# EAGLE board IceLogicBus (EAGLE 7.5.0)
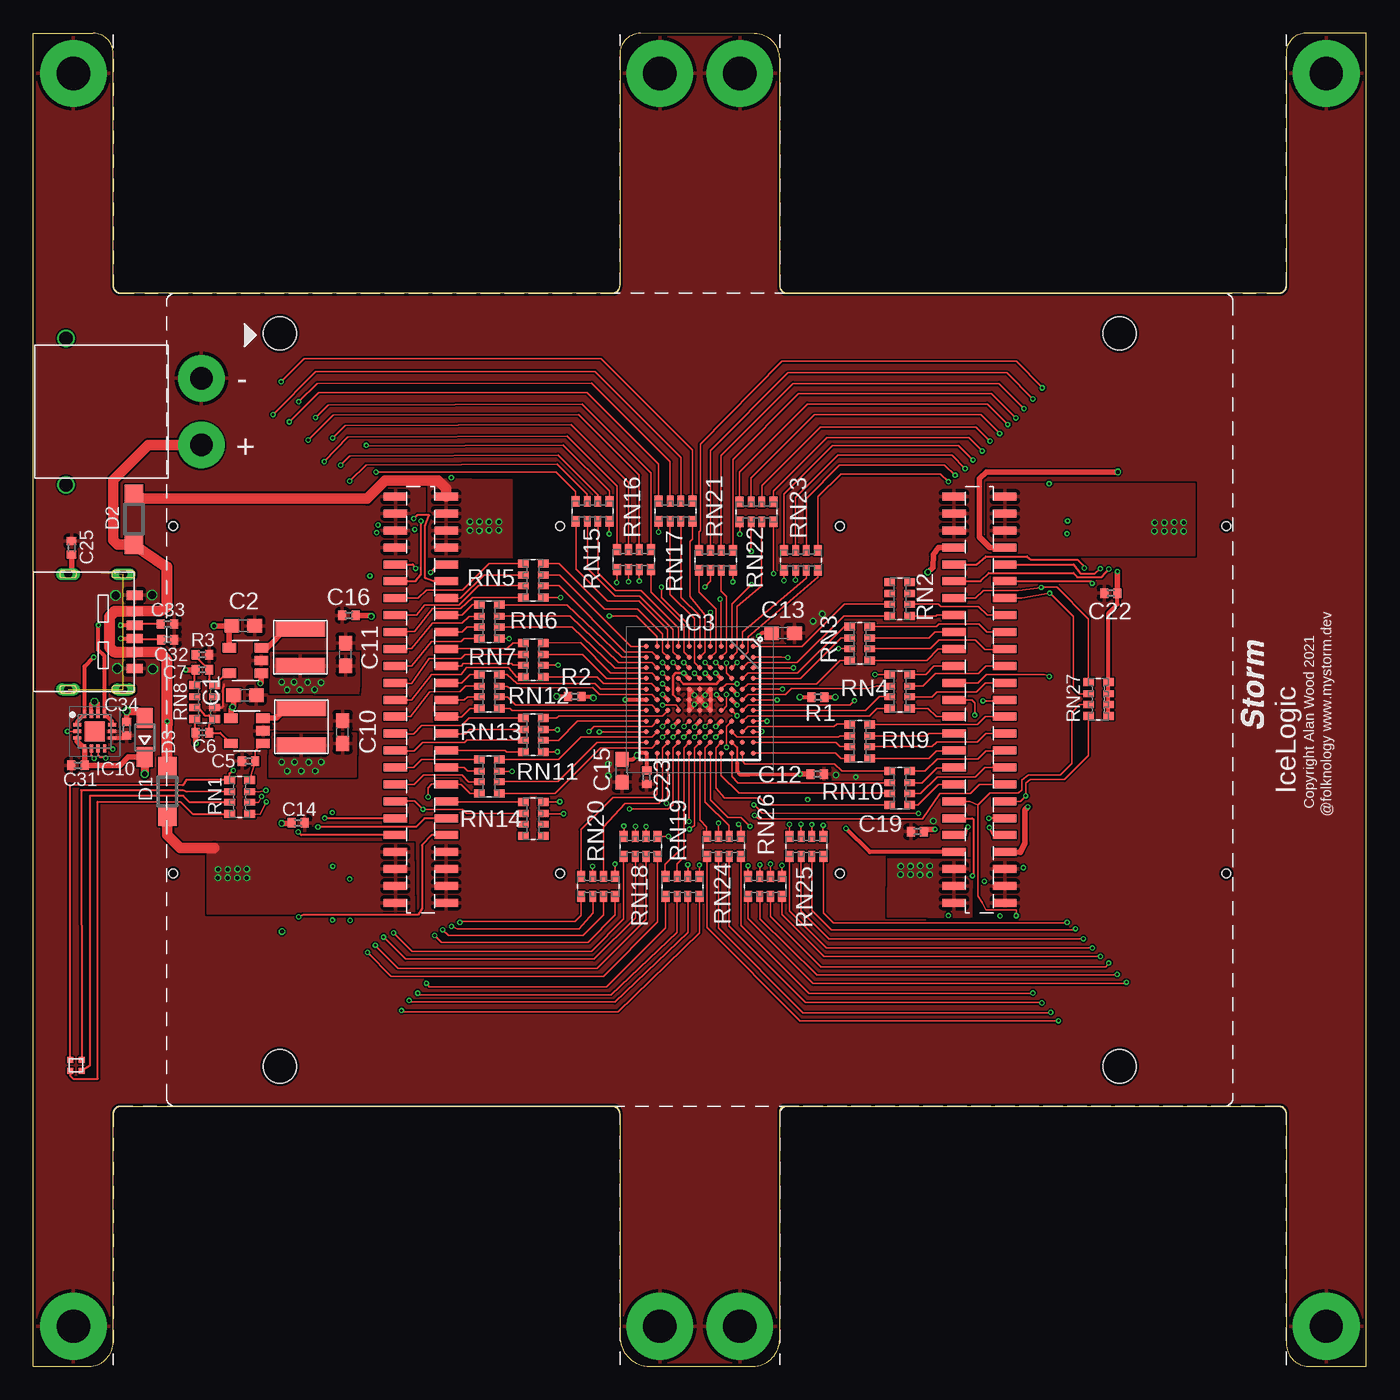
[diagram p1: board, top side]
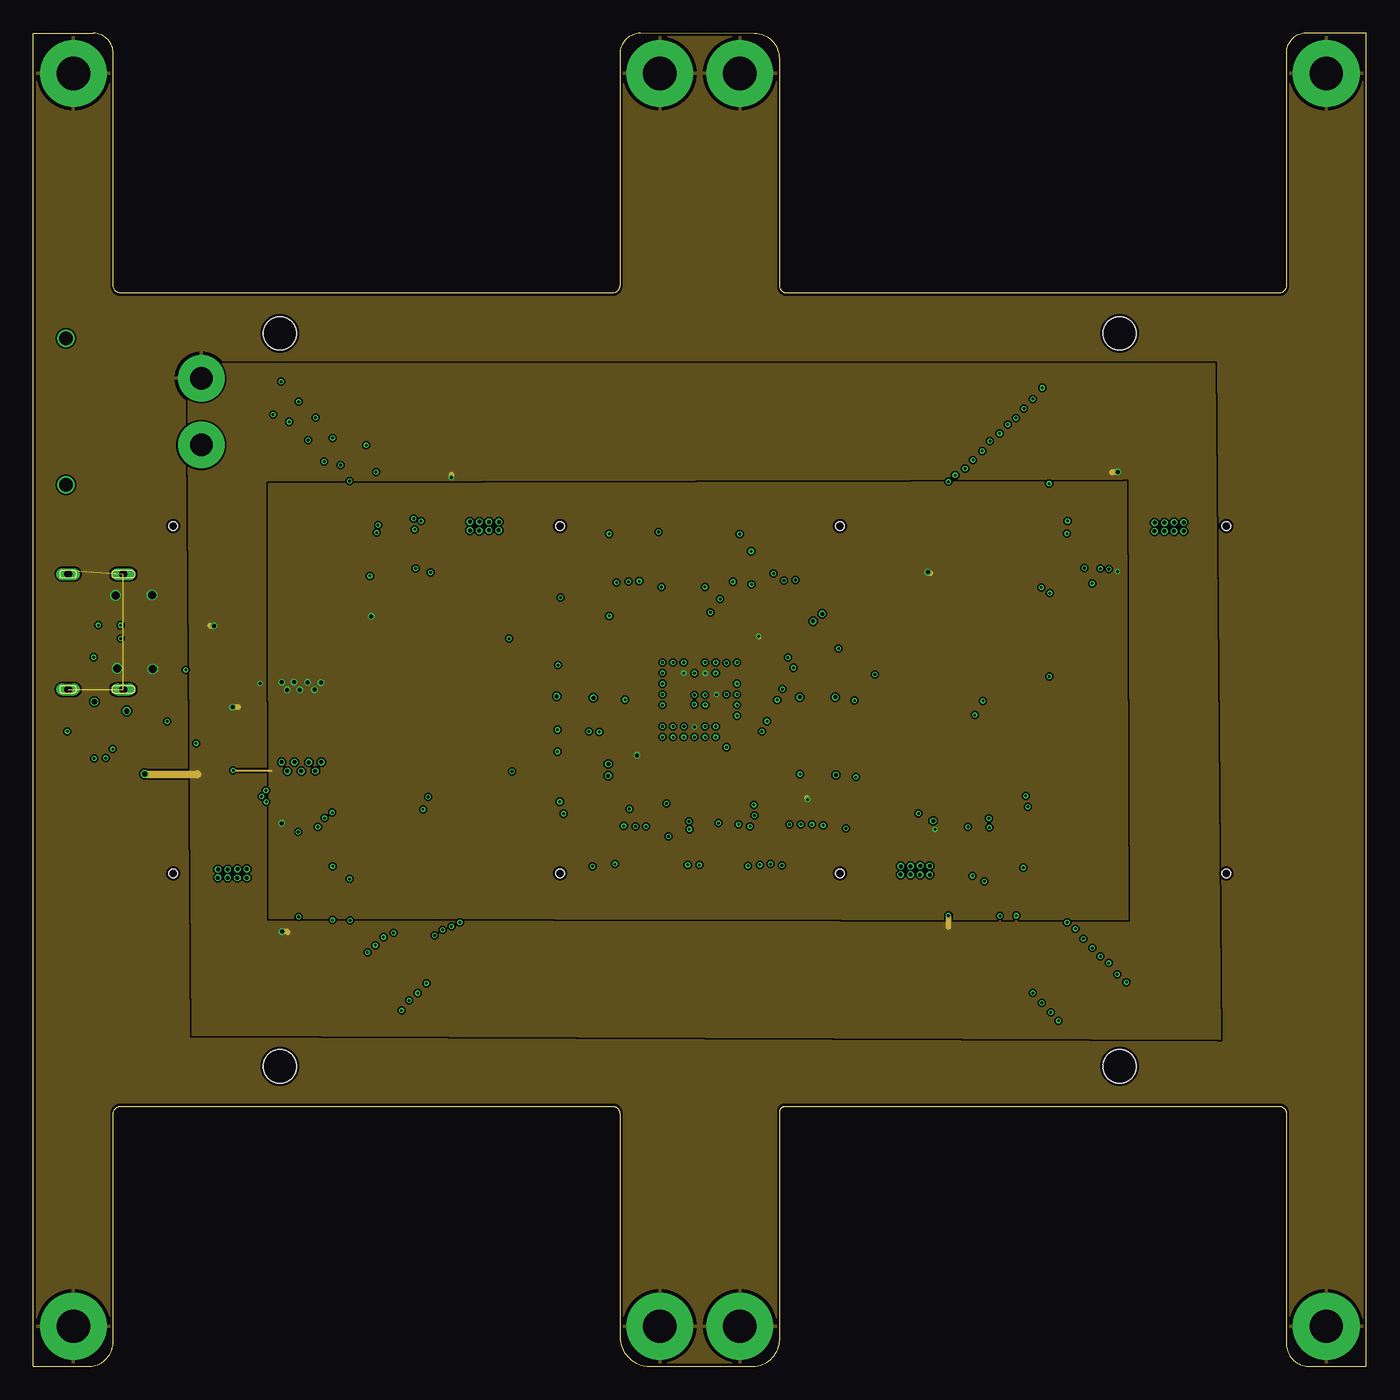
[diagram p2: board, inner layer Route2]
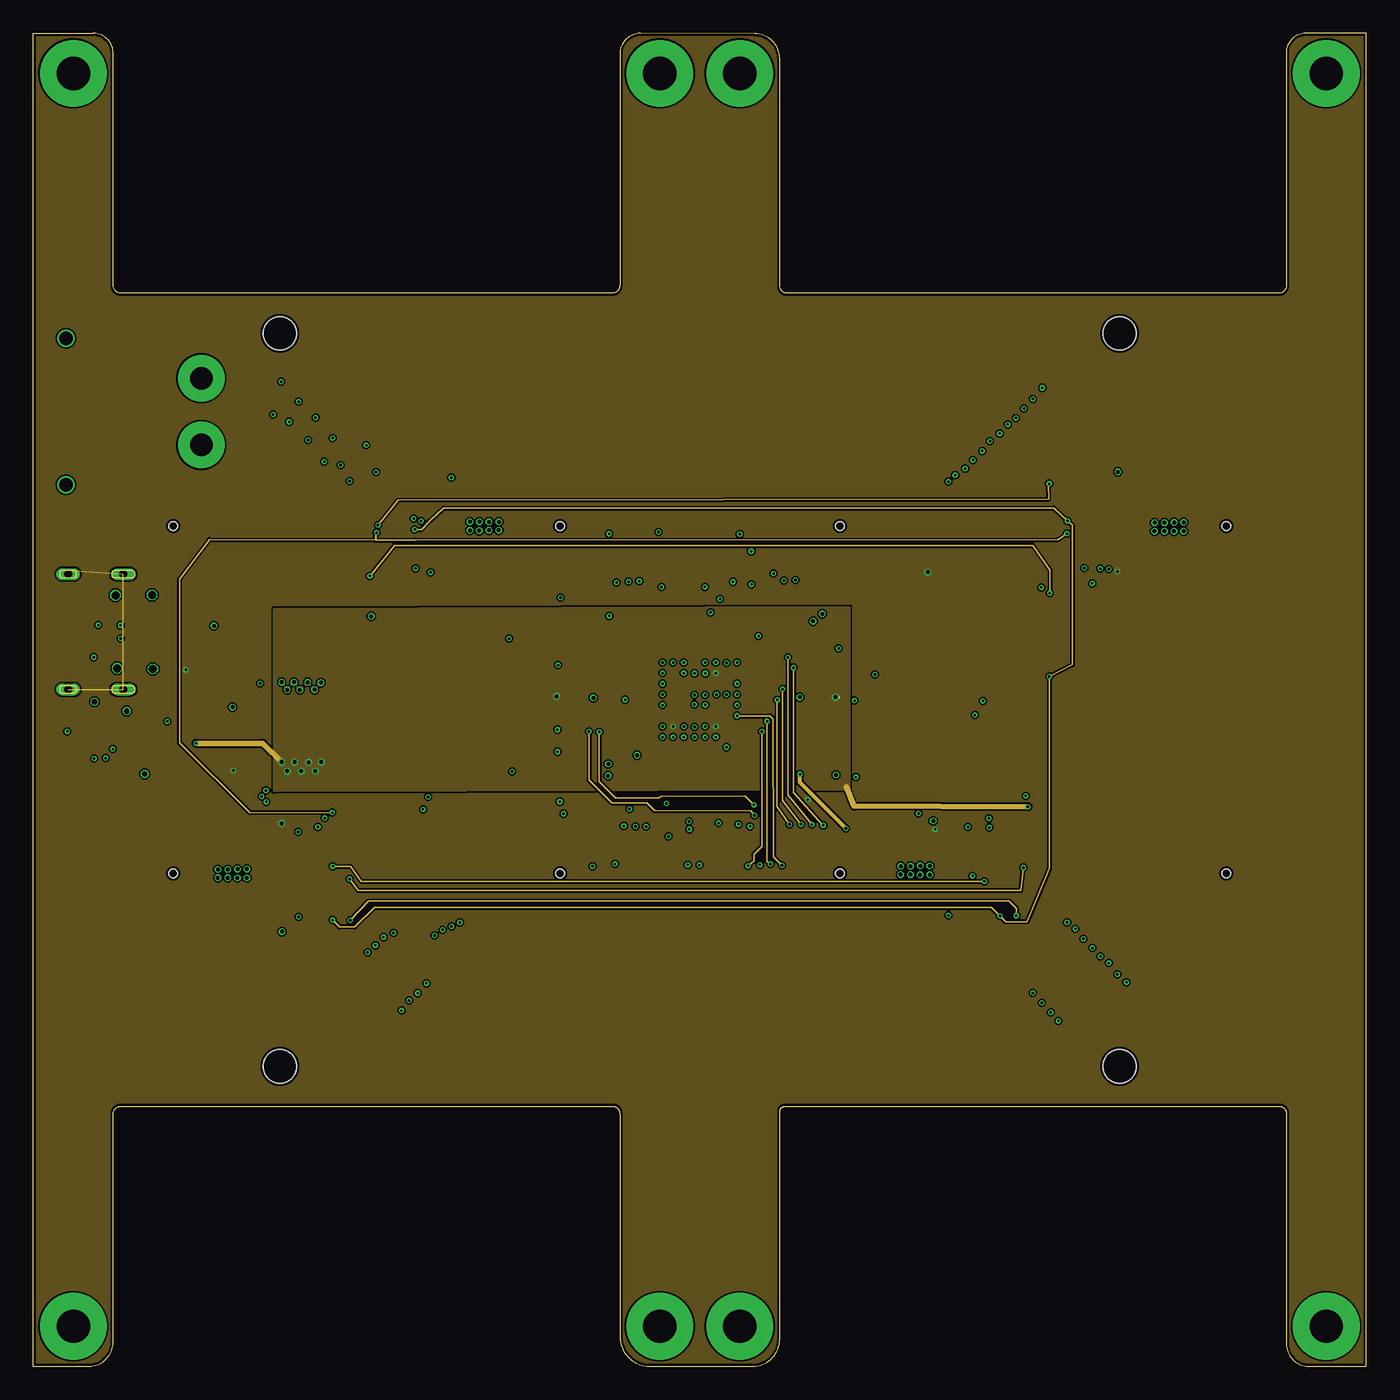
[diagram p3: board, inner layer Route15]
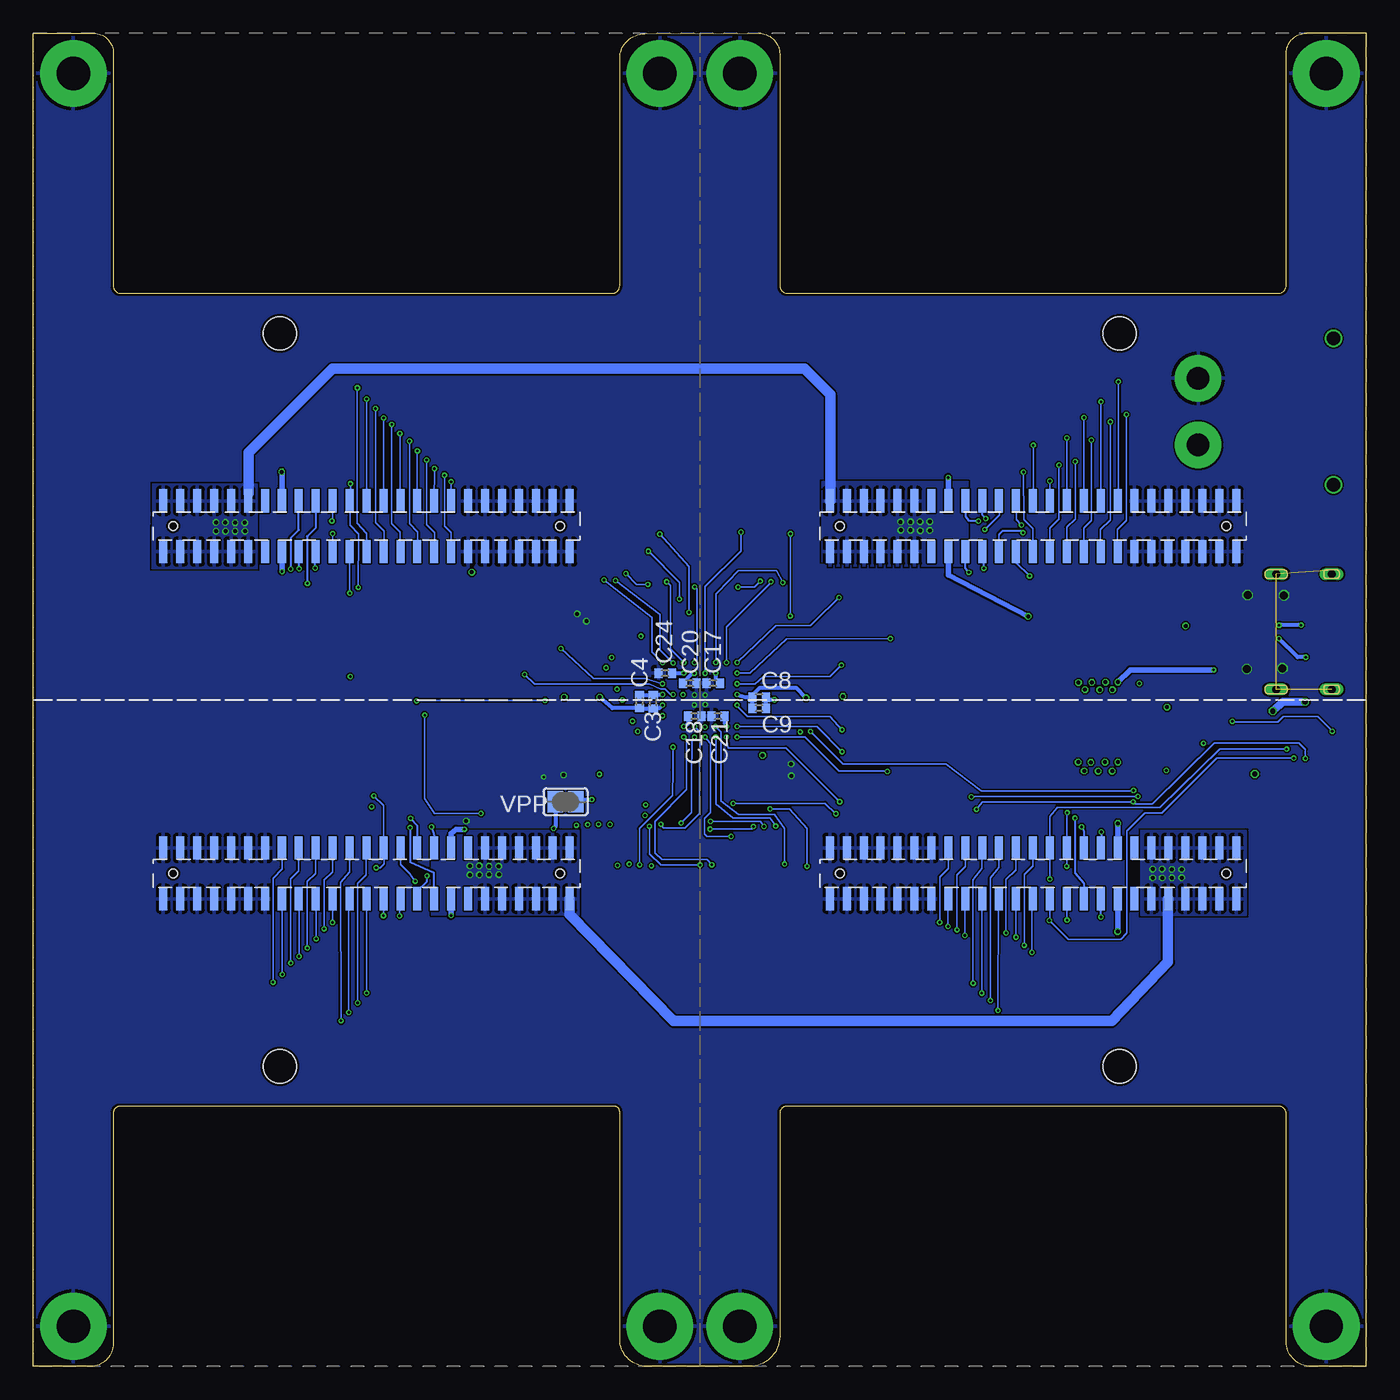
[diagram p4: board, bottom side, seen from below]

Size 100 x 100 mm. Coordinates in mm from the lower left corner, seen from the top.
Outline: 100,100 95.47,100 arc90 94,98.53 94,81.05 arc-90 93.45,80.5 56.56,80.5 arc-90 56,81.06 56,98.09 arc90 54.11,99.98 45.56,100 arc90 44,98.44 44,81.08 arc-90 43.42,80.5 6.59,80.5 arc-90 6,81.09 6,98.5 arc90 4.5,100 0,100 0,0 4.17,0 arc90 6,1.83 6,18.93 arc-90 6.57,19.5 43.46,19.5 arc-90 44,18.96 44,2.23 arc90 46.23,0 53.99,0 arc90 56,2.01 56,19.09 arc-90 56.41,19.5 93.5,19.5 arc-90 94,19 94,1.68 arc90 95.68,0 100,0 100,100
Copper layers (1*2*15*16): Top 0.035559375mm / dielectric 0.17018125mm / Route2 0.01778125mm / dielectric 47mil / Route15 0.01778125mm / dielectric 0.17018125mm / Bottom 0.035559375mm
Design rules "jcl-4layer *": minimum track width 3.5mil, minimum drill 0.2mm, track to track 5mil, track to pad 5mil, pad to pad 5mil, via to via 5mil, smd to smd 5mil, copper to edge 0.2mm, drill to drill 5mil, minimum pad ring 0.15mm, minimum via ring 0.09mm, stop-mask expansion 2.5mil, vias tented up to drill 0.3mm, thermal gap 10mil

## Footprints (pad centres in the part's own frame; a part is rotated, then mirrored left to right if it is on the bottom)
C0603 = smd 1.1 x 1: 1 -0.85,0; 2 0.85,0
C0402 = smd 0.6 x 0.7: 1 -0.5,0; 2 0.5,0
SOD123 = smd 1.4 x 1.4: A 1.9,0; C -1.9,0
SOD323-W = smd 1.5 x 1.2: A 1.45,0; C -1.45,0
TSOP-5/SOT23-5 = smd 0.7 x 1: 1 0.95,1.2; 2 0,1.2; 3 -0.95,1.2; 4 -0.95,-1.2; 5 0.95,-1.2
BGA121C80P11X11_900X900X110 = smd 0.37 x 0.37: A1 -4,4; A2 -3.2,4; A3 -2.4,4; A4 -1.6,4; A5 -0.8,4; A6 0,4; A7 0.8,4; A8 1.6,4; A9 2.4,4; A10 3.2,4; A11 4,4; B1 -4,3.2; B2 -3.2,3.2; B3 -2.4,3.2; B4 -1.6,3.2; B5 -0.8,3.2; B6 0,3.2; B7 0.8,3.2; B8 1.6,3.2; B9 2.4,3.2; B10 3.2,3.2; B11 4,3.2; C1 -4,2.4; C2 -3.2,2.4; C3 -2.4,2.4; C4 -1.6,2.4; C5 -0.8,2.4; C6 0,2.4; C7 0.8,2.4; C8 1.6,2.4; C9 2.4,2.4; C10 3.2,2.4; C11 4,2.4; D1 -4,1.6; D2 -3.2,1.6; D3 -2.4,1.6; D4 -1.6,1.6; D5 -0.8,1.6; D6 0,1.6; D7 0.8,1.6; D8 1.6,1.6; D9 2.4,1.6; D10 3.2,1.6; D11 4,1.6; E1 -4,0.8; E2 -3.2,0.8; E3 -2.4,0.8; E4 -1.6,0.8; E5 -0.8,0.8; E6 0,0.8; E7 0.8,0.8; E8 1.6,0.8; E9 2.4,0.8; E10 3.2,0.8; E11 4,0.8; F1 -4,0; F2 -3.2,0; F3 -2.4,0; F4 -1.6,0; F5 -0.8,0; F6 0,0; F7 0.8,0; F8 1.6,0; F9 2.4,0; F10 3.2,0; F11 4,0; G1 -4,-0.8; G2 -3.2,-0.8; G3 -2.4,-0.8; G4 -1.6,-0.8; G5 -0.8,-0.8; G6 0,-0.8; G7 0.8,-0.8; G8 1.6,-0.8; G9 2.4,-0.8; G10 3.2,-0.8; G11 4,-0.8; H1 -4,-1.6; H2 -3.2,-1.6; H3 -2.4,-1.6; H4 -1.6,-1.6; H5 -0.8,-1.6; H6 0,-1.6; H7 0.8,-1.6; H8 1.6,-1.6; H9 2.4,-1.6; H10 3.2,-1.6; H11 4,-1.6; J1 -4,-2.4; J2 -3.2,-2.4; J3 -2.4,-2.4; J4 -1.6,-2.4; J5 -0.8,-2.4; J6 0,-2.4; J7 0.8,-2.4; J8 1.6,-2.4; J9 2.4,-2.4; J10 3.2,-2.4; J11 4,-2.4; K1 -4,-3.2; K2 -3.2,-3.2; K3 -2.4,-3.2; K4 -1.6,-3.2; K5 -0.8,-3.2; K6 0,-3.2; K7 0.8,-3.2; K8 1.6,-3.2; K9 2.4,-3.2; K10 3.2,-3.2; K11 4,-3.2; L1 -4,-4; L2 -3.2,-4; L3 -2.4,-4; L4 -1.6,-4; L5 -0.8,-4; L6 0,-4; L7 0.8,-4; L8 1.6,-4; L9 2.4,-4; L10 3.2,-4; L11 4,-4
QFN50P250X250X80-15N = smd 0.6 x 0.25: 1 -1.3,0.5; 2 -1.3,0; 3 -1.3,-0.5; 8 1.3,-0.5; 9 1.3,0; 10 1.3,0.5 | smd 0.25 x 0.6: 4 -0.75,-1.3; 5 -0.25,-1.3; 6 0.25,-1.3; 7 0.75,-1.3; 11 0.75,1.3; 12 0.25,1.3; 13 -0.25,1.3; 14 -0.75,1.3 | smd 1.5 x 1.5: 15 0,0
NRC4018 = smd 1.2 x 3.7: P$1 -1.4,0; P$2 1.4,0
RGB_LED_IMM = smd 0.45 x 0.45: A 0.425,0.425; B -0.425,0.425; G -0.425,-0.425; R 0.425,-0.425
R0402 = smd 0.6 x 0.7: 1 -0.5,0; 2 0.5,0
EXB38V = smd 0.6 x 0.8: 1 -1.275,-0.75; 4 1.275,-0.75; 5 1.275,0.75; 8 -1.275,0.75 | smd 0.5 x 0.8: 2 -0.4,-0.75; 3 0.4,-0.75; 6 0.4,0.75; 7 -0.4,0.75
UTILE_LP = drill 2.5 pad 5: 0V@1 22.5,22; 0V@2 22.5,-22 | smd 1.75 x 0.6: P$1 -13.385,-15.24; P$2 -13.385,-13.97; P$3 -13.385,-12.7; P$4 -13.385,-11.43; P$5 -13.385,-10.16; P$6 -13.385,-8.89; P$7 -13.385,-7.62; P$8 -13.385,-6.35; P$9 -13.385,-5.08; P$10 -13.385,-3.81; P$11 -13.385,-2.54; P$12 -13.385,-1.27; P$13 -13.385,0; P$14 -13.385,1.27; P$15 -13.385,2.54; P$16 -13.385,3.81; P$17 -13.385,5.08; P$18 -13.385,6.35; P$19 -13.385,7.62; P$20 -13.385,8.89; P$21 -13.385,10.16; P$22 -13.385,11.43; P$23 -13.385,12.7; P$24 -13.385,13.97; P$25 -13.385,15.24; P$26 -9.575,-15.24; P$27 -9.575,-13.97; P$28 -9.575,-12.7; P$29 -9.575,-11.43; P$30 -9.575,-10.16; P$31 -9.575,-8.89; P$32 -9.575,-7.62; P$33 -9.575,-6.35; P$34 -9.575,-5.08; P$35 -9.575,-3.81; P$36 -9.575,-2.54; P$37 -9.575,-1.27; P$38 -9.575,0; P$39 -9.575,1.27; P$40 -9.575,2.54; P$41 -9.575,3.81; P$42 -9.575,5.08; P$43 -9.575,6.35; P$44 -9.575,7.62; P$45 -9.575,8.89; P$46 -9.575,10.16; P$47 -9.575,11.43; P$48 -9.575,12.7; P$49 -9.575,13.97; P$50 -9.575,15.24 | hole 0.65: -11.48,14.5; -11.48,-14.5
MEZZANINE = smd 1.75 x 0.6: E1 -22.885,15.24; E2 -22.885,13.97; E3 -22.885,12.7; E4 -22.885,11.43; E5 -22.885,10.16; E6 -22.885,8.89; E7 -22.885,7.62; E8 -22.885,6.35; E9 -22.885,5.08; E10 -22.885,3.81; E11 -22.885,2.54; E12 -22.885,1.27; E13 -22.885,0; E14 -22.885,-1.27; E15 -22.885,-2.54; E16 -22.885,-3.81; E17 -22.885,-5.08; E18 -22.885,-6.35; E19 -22.885,-7.62; E20 -22.885,-8.89; E21 -22.885,-10.16; E22 -22.885,-11.43; E23 -22.885,-12.7; E24 -22.885,-13.97; E25 -22.885,-15.24; E26 -19.075,15.24; E27 -19.075,13.97; E28 -19.075,12.7; E29 -19.075,11.43; E30 -19.075,10.16; E31 -19.075,8.89; E32 -19.075,7.62; E33 -19.075,6.35; E34 -19.075,5.08; E35 -19.075,3.81; E36 -19.075,2.54; E37 -19.075,1.27; E38 -19.075,0; E39 -19.075,-1.27; E40 -19.075,-2.54; E41 -19.075,-3.81; E42 -19.075,-5.08; E43 -19.075,-6.35; E44 -19.075,-7.62; E45 -19.075,-8.89; E46 -19.075,-10.16; E47 -19.075,-11.43; E48 -19.075,-12.7; E49 -19.075,-13.97; E50 -19.075,-15.24; W1 19.025,15.24; W2 19.025,13.97; W3 19.025,12.7; W4 19.025,11.43; W5 19.025,10.16; W6 19.025,8.89; W7 19.025,7.62; W8 19.025,6.35; W9 19.025,5.08; W10 19.025,3.81; W11 19.025,2.54; W12 19.025,1.27; W13 19.025,0; W14 19.025,-1.27; W15 19.025,-2.54; W16 19.025,-3.81; W17 19.025,-5.08; W18 19.025,-6.35; W19 19.025,-7.62; W20 19.025,-8.89; W21 19.025,-10.16; W22 19.025,-11.43; W23 19.025,-12.7; W24 19.025,-13.97; W25 19.025,-15.24; W26 22.835,15.24; W27 22.835,13.97; W28 22.835,12.7; W29 22.835,11.43; W30 22.835,10.16; W31 22.835,8.89; W32 22.835,7.62; W33 22.835,6.35; W34 22.835,5.08; W35 22.835,3.81; W36 22.835,2.54; W37 22.835,1.27; W38 22.835,0; W39 22.835,-1.27; W40 22.835,-2.54; W41 22.835,-3.81; W42 22.835,-5.08; W43 22.835,-6.35; W44 22.835,-7.62; W45 22.835,-8.89; W46 22.835,-10.16; W47 22.835,-11.43; W48 22.835,-12.7; W49 22.835,-13.97; W50 22.835,-15.24 | hole 2.5: -31.5,-27.5; 31.5,-27.5; -31.5,27.5; 31.5,27.5
USB-C-6 = smd 0.7 x 1.2: CC1 -0.5,5; CC2 0.5,5; GND@1 -2.75,5; GND@2 2.75,5; VBUS@1 -1.52,5; VBUS@2 1.52,5 | drill 0.6 long: P$1 -4.32,4.15; P$2 4.32,4.15; P$3 -4.32,0; P$4 4.32,0
XT30PW-M = drill 1.7 pad 3.5: P$1 2.5,0; P$2 -2.5,0 | drill 1: P$3 -5.5,10.16; P$4 5.5,10.16
SJ = smd 1.168 x 1.6: 1 -0.762,0; 2 0.762,0

## Placement (x,y rotation side)
C1  22uf  [C0603]  15.88,50.35 180 top
C2  22uf  [C0603]  15.75,55.55 180 top
C3  470nf  [C0402]  53.5,49.85 270 bottom
C4  4u7  [C0402]  54.52,49.88 270 bottom
C5  470nf  [C0402]  16.15,45.39 180 top
C6  22pf  [C0402]  12.68,47.52 180 top
C7  22pf  [C0402]  12.68,52.25 180 top
C8  4u7  [C0402]  45.55,50.2 180 bottom
C9  470nf  [C0402]  45.55,49.37 180 bottom
C10  22uf  [C0603]  23.2,47.58 90 top
C11  22uf  [C0603]  23.43,53.4 90 top
C12  470nf  [C0402]  58.82,44.41 180 top
C13  22uf  [C0603]  56.26,55 0 top
C14  470nf  [C0402]  19.87,40.77 180 top
C15  22uf  [C0603]  44.16,44.67 90 top
C16  470nf  [C0402]  23.68,56.34 0 top
C17  470nf  [C0402]  49,51.25 180 bottom
C18  470nf  [C0402]  50.38,48.77 180 bottom
C19  470nf  [C0402]  66.33,40.1 0 top
C20  470nf  [C0402]  50.75,51.25 0 bottom
C21  470nf  [C0402]  48.63,48.77 0 bottom
C22  470nf  [C0402]  80.84,57.99 0 top
C23  470nf  [C0402]  46.02,44.2 270 top
C24  470nf  [C0402]  52.6,52 0 bottom
C25  470nf  [C0402]  2.87,61.4 270 top
C31  470nf  [C0402]  3.35,45.08 0 top
C32  470pf  [C0402]  10.08,54.51 180 top
C33  470pf  [C0402]  10.07,55.68 0 top
C34  470nf  [C0402]  7.01,47.83 90 top
D1  [SOD123]  10.05,43.12 90 top
D2  [SOD123]  7.54,63.53 270 top
D3  [SOD323-W]  8.35,47.17 90 top
IC1  [TSOP-5/SOT23-5]  16.02,47.67 270 top
IC2  [TSOP-5/SOT23-5]  15.9,52.95 270 top
IC3  ICE40HX4K-BG121  [BGA121C80P11X11_900X900X110]  50,50 270 top
IC10  FUSB302MPX  [QFN50P250X250X80-15N]  4.6,47.63 0 top
L1  NRS4018  [NRC4018]  20.1,47.98 270 top
L2  NRS4018  [NRC4018]  20.02,53.95 270 top
L3  RGB_LED  [RGB_LED_IMM]  3.19,22.57 90 top
R1  100r  [R0402]  58.87,50.2 180 top
R2  100r  [R0402]  40.63,50.25 180 top
R3  27k  [R0402]  12.68,53.38 0 top
RN1  1k5  [EXB38V]  15.47,42.7 270 top
RN2  22r  [EXB38V]  65,57.58 270 top
RN3  22r  [EXB38V]  62,54.23 90 top
RN4  22r  [EXB38V]  65,50.62 90 top
RN5  22r  [EXB38V]  37.5,58.95 270 top
RN6  22r  [EXB38V]  34.2,55.86 270 top
RN7  22r  [EXB38V]  37.5,52.99 270 top
RN8  120k  [EXB38V]  12.85,49.83 90 top
RN9  22r  [EXB38V]  62,46.88 90 top
RN10  22r  [EXB38V]  65,43.37 90 top
RN11  22r  [EXB38V]  34.2,44.25 270 top
RN12  22r  [EXB38V]  34.2,50.62 270 top
RN13  22r  [EXB38V]  37.5,47.37 270 top
RN14  22r  [EXB38V]  37.5,41.06 270 top
RN15  22r  [EXB38V]  41.95,64.14 0 top
RN16  22r  [EXB38V]  45.05,60.52 0 top
RN17  22r  [EXB38V]  48.17,64.15 0 top
RN18  22r  [EXB38V]  45.57,39 0 top
RN19  22r  [EXB38V]  48.7,36 0 top
RN20  22r  [EXB38V]  42.38,36 0 top
RN21  22r  [EXB38V]  51.2,60.48 0 top
RN22  22r  [EXB38V]  54.26,64.1 0 top
RN23  22r  [EXB38V]  57.59,60.48 0 top
RN24  22r  [EXB38V]  51.8,39 0 top
RN25  22r  [EXB38V]  58,39 0 top
RN26  22r  [EXB38V]  54.9,36 0 top
RN27  2k4  [EXB38V]  79.92,50.04 90 top
T1  UTILE_LPCARRIER_SMD_MALE_1.27  [UTILE_LP]  25,74.5 90 bottom
T2  UTILE_LPCARRIER_SMD_MALE_1.27  [UTILE_LP]  25,25.5 270 bottom
T3  [MEZZANINE]  50,50 180 top
T4  UTILE_LPCARRIER_SMD_MALE_1.27  [UTILE_LP]  75,74.5 90 bottom
T5  UTILE_LPCARRIER_SMD_MALE_1.27  [UTILE_LP]  75,25.5 270 bottom
U$1  USB-C-6  [USB-C-6]  2.6,55.1 270 top
U$2  XT-XXXT  [XT30PW-M]  12.61,71.62 90 top
VPP  [SJ]  60.07,42.34 180 bottom

## Tracks (layer width: path | path; a pad name or v marks a point on that pad's centre or on a via)
!CS0
  Top 0.127: RN5.3 33.41,58.55 31.95,57.12 29.37,57.12 28.76,56.35 T3.W43
!CS1
  Top 0.127: RN5.1 34.19,60.23 32.2,58.24 29.5,58.24 28.88,57.62 T3.W44
!HB
  Top 0.127: RN12.1 32.78,51.9 32.14,51.26 T3.W14
!INT  (via drill 0.2)
  Top 0.127: RN14.2 32.52,41.47 32.2,41.78 v29.23,41.78 28.62,42.39 27.18,42.39 T3.W32 | RN1.5 17.02,41.41 v17.48,42.34 | IC10.5 4.35,45.84 v4.56,45.6
  Bottom 0.127: v29.23,41.78 28.8,42.34 v17.48,42.34 17.36,42.18 16.03,42.19 11.38,46.74 5.05,46.74 4.56,46.28 v4.56,45.6
!LB
  Top 0.127: RN12.2 32.44,51.02 32.02,50.61 29.72,50.6 28.31,48.73 T3.W37
!OE
  Top 0.127: RN4.3 66.74,51.02 67.69,51.97 70.92,51.97 71.48,52.53 72.88,52.53 T3.E15
!SS  (via drill 0.2)
  Top 0.127: RN11.4 32.78,42.98 32.11,43.65 T3.W8 30.95,43.67 29.89,43.67 29.62,43.4 v29.62,42.71 | RN1.6 16.91,42.3 v17.12,42.74
  Bottom 0.127: v17.12,42.74 29.37,42.75 v29.62,42.71
!WE
  Top 0.127: RN4.4 66.95,51.9 67.58,52.52 69.06,52.52 T3.E40
+2V5  (via drill 0.2)
  Top 0.15: IC3.C10 52.8,46.43 52.8,45.23
  Top 0.3: 52.8,45.23 52.8,44.64 53.03,44.41 53.73,44.41 v57.53,44.41 C12.2 | T3.E29 62.75,38.57 v60.97,40.35
  Top 0.406: v57.53,44.41 C12.2
  Route15 0.3: v60.97,40.35 57.53,43.79 v57.53,44.41
  Bottom 0.3: VPP.2 60.83,40.49 v60.97,40.35
+3V3  (via drill 0.2, 0.3)
  Top 0.15: RN8.5 12.1,52.17 C7.2 | L3.A 2.74,23.02 2.74,23.6 2.72,43.59 11.2,43.58 11.45,43.98 RN1.1 14.72,44.48 v15,44.69
  Top 0.17: 48,50.41 48,51.77 48.19,52 v48.8,52
  Top 0.2: 50,48.49 IC3.F8 | IC3.H6 48,50.41
  Top 0.3: IC3.D6 v51.26,50.38 | IC3.F8 49.61,48.01 v49.61,47.96 | IC3.G4 49.17,51.6 v48.8,52 | C23.1 46.02,45.98 IC3.L11 45.46,46 v45.29,45.83 44.98,45.52 C15.2 | IC3.E4 v50.41,51.99 | C13.1 54.65,55 v54.42,54.77
  Top 0.305: RN27.1 RN27.2 RN27.3 RN27.4 80.67,56.5 81.34,57.17 C22.2
  Top 0.406: C7.2 v11.45,52.25 v11.44,52.24 | v18.63,40.73 19.34,40.73 C14.2 | v25.36,56.25 25.36,56.34 C16.2 | v67.65,40.28 66.91,40.28 C19.2 | v81.34,59.62 C22.2 | T3.E47 67.92,61.43 67.52,60.9 67.49,59.92 v67.11,59.57
  Route2 0.15: v15,44.69 17.82,44.69 17.85,44.66
  Route2 0.3: v54.42,54.77 54.42,54.7 54.45,54.67
  Route2 0.406: v67.11,59.57 67.3,59.51 | v58.1,42.51 58.03,42.64
  Bottom 0.3: v45.29,45.83 v45.28,45.83 45.25,45.8 | C17.1 48.8,51.55 v48.8,52 | C20.1 50.58,51.98 v50.41,51.99 | VPP.1 58.94,42.51 v58.1,42.51
  Bottom 0.406: v11.44,52.24 17.71,52.24 v18.63,51.32 | T2.P$18 18.65,40.71 v18.63,40.73 | T1.P$18 31.34,59.38 v25.36,56.25 | T5.P$18 68.65,39.96 68.3,40.28 v67.65,40.28 | T4.P$18 v81.35,59.63 v81.34,59.62
  other vias: 19.04,50.75 19.56,51.32 19.99,50.75 20.58,51.31 21.1,50.76 21.58,51.29
  pour Route15 (rank 2): 0,100 100,100 100,0 0,0
  pour Top: 24.38,50.45 17.82,50.49 17.77,53.54 24.39,53.57 24.43,51.15
  pour Route2: 17.7,66.22 81.95,66.38 82.07,33.49 17.75,33.59
+5V  (via drill 0.2, 0.3, 0.4)
  Top 0.406: v13.55,55.54 v13.56,55.55 C2.2 14.7,55.35 IC2.4 | IC2.1 17.1,51.3 v17.02,51.22 | C1.2 15.03,49.52 v14.95,49.45 14.82,49.33 IC1.4 | T3.E22 71.78,61.43 70.99,62.22 70.99,66.6 71.49,67.1 v81.36,67.1 v81.37,67.09 | IC10.3 3.3,46.88 IC10.4 C31.2 6.51,45.08 7.11,45.72 D3.C
  Top 0.61: D3.C 8.35,44.41 v8.36,44.43
  Route2 0.406: v13.55,55.54 13.31,55.54 13.27,55.58 | v17.02,51.22 v17.03,51.23 | v14.95,49.45 15.35,49.45 15.36,49.46 | v18.65,32.61 19.03,32.61 19.09,32.55 | v31.36,66.67 31.37,66.91 | v81.37,67.09 80.96,67.09 80.92,67.05 | v68.66,33.81 68.66,32.97
  Route2 0.61: v8.36,44.43 12.3,44.4
  Bottom 0.406: T2.P$43 v18.65,32.61 | T1.P$43 v31.36,66.67 | T4.P$43 81.35,67.07 v81.37,67.09 | T5.P$43 v68.65,33.82 v68.66,33.81
  pour Route2 (rank 2): 11.63,75.26 88.61,75.22 89.01,24.52 11.96,24.81
A4
  Top 0.127: RN13.1 32.69,48.64 32.12,48.07 29.14,48.07 28.52,47.45 27.18,47.45 T3.W36
A5
  Top 0.127: RN13.2 32.74,47.77 32.42,47.44 31,47.44 T3.W11
A6
  Top 0.127: RN12.3 32.56,50.23 32.32,49.98 31,49.98 T3.W13
A7
  Top 0.127: RN13.4 35.49,46.09 35.4,46.18 T3.W10
A8
  Top 0.127: RN12.4 32.75,49.35 32.12,48.72 T3.W12
A9
  Top 0.127: RN13.3 32.52,46.97 32.34,46.78 29.2,46.78 28.58,46.16 27.2,46.16 T3.W35
A10
  Top 0.127: RN14.1 31.02,42.34 T3.W7
A11
  Top 0.127: RN7.4 36.26,51.72 35.65,52.43 32.51,52.43 32.08,51.9 29.87,51.9 28.37,49.99 27.18,49.99 T3.W38
A12
  Top 0.127: T3.W15 32.12,52.54 32.23,52.7 35.88,52.7 35.98,52.59 RN7.3
A13
  Top 0.127: RN7.1 35.98,54.27 35.54,53.83 31,53.83 T3.W16
A14
  Top 0.127: RN7.2 32.4,53.4 32.1,53.1 29.69,53.1 28.38,51.23 27.2,51.23 T3.W39
A15
  Top 0.127: RN6.3 32.55,55.46 32.17,55.08 T3.W17
A16
  Top 0.127: RN6.4 32.31,54.59 32.11,54.38 29.88,54.38 28.39,52.54 T3.W40
A17
  Top 0.127: RN6.2 32.68,56.26 32.18,55.76 29.97,55.77 28.38,53.83 27.18,53.83 T3.W41
A18
  Top 0.127: RN6.1 32.97,57.13 32.17,56.34 T3.W18
A19
  Top 0.127: RN5.4 32.94,57.67 32.06,56.85 29.94,56.85 28.59,55.12 27.2,55.12 T3.W42
A20
  Top 0.127: RN5.2 33.81,59.37 32.07,57.62 T3.W19
CC1  (via drill 0.2)
  Top 0.15: C33.1 7.68,55.68 U$1.CC1
  Top 0.305: v6.54,55.59 U$1.CC1 | v4.88,55.6 4.86,55.58 4.86,53.75 5.34,53.27 5.34,52.53 5.35,52.52 IC10.11 5.9,48.38 IC10.10
  Bottom 0.305: v4.88,55.6 v6.53,55.6 v6.54,55.59
CC2  (via drill 0.2)
  Top 0.15: C32.2 7.69,54.51 U$1.CC2
  Top 0.305: v4.53,53.19 3.85,52.51 IC10.14 3.3,48.38 IC10.1 | v6.55,54.59 U$1.CC2
  Bottom 0.305: v4.53,53.19 5.15,53.19 v6.55,54.59
D0
  Top 0.127: RN10.4 66.91,44.65 67.82,45.56 70.88,45.56 71.48,46.16 72.86,46.16 T3.E10
D1
  Top 0.127: RN9.1 67.2,45.6 67.77,46.17 69.06,46.17 T3.E35
D2
  Top 0.127: RN9.2 67.42,46.48 67.79,46.85 70.84,46.85 71.47,47.48 72.86,47.48 T3.E11
D3
  Top 0.127: RN9.4 70.84,48.16 71.42,48.73 T3.E12
D4
  Top 0.127: RN9.3 67.02,47.28 67.2,47.46 T3.E36
D5
  Top 0.127: RN4.1 67.12,49.34 67.74,48.73 T3.E37
D6
  Top 0.127: RN4.2 67.41,50.22 67.78,50.59 70.74,50.59 71.42,51.27 T3.E14
D7
  Top 0.127: RN3.1 67.03,52.96 67.87,53.8 69.06,53.8 T3.E41
D8
  Top 0.127: RN3.2 67.31,53.84 67.95,54.48 70.67,54.48 71.39,53.76 72.83,53.76 T3.E16
D9
  Top 0.127: RN3.3 67.19,54.63 67.66,55.1 69.06,55.1 T3.E42
D10
  Top 0.127: RN3.4 67.76,55.51 67.94,55.69 70.95,55.69 71.54,55.1 72.86,55.1 T3.E17
D11
  Top 0.127: RN2.5 67.72,56.3 67.79,56.37 69.06,56.37 T3.E43
D12
  Top 0.127: RN2.6 67.89,57.17 68.08,56.99 70.92,56.99 71.57,56.34 72.88,56.34 T3.E18
D13
  Top 0.127: RN10.3 66.68,43.77 67.81,44.9 69.06,44.9 T3.E34
D14
  Top 0.127: RN10.1 66.39,42.09 67.92,43.63 69.06,43.63 T3.E33
D15
  Top 0.127: RN10.2 66.57,42.97 67.82,44.22 70.68,44.22 71.38,44.92 T3.E9
DONE  (via drill 0.2)
  Top 0.127: IC3.K8 46.41,48.01 42.07,48.01 v41.68,47.62 | T3.E8 70.98,43.65 70.3,42.97 68,42.97 66.71,41.06 54.44,41.06 v54.11,41.32 | v17.45,43.2 16.87,43.1 RN1.7
  Route15 0.127: v41.68,47.62 41.68,43.98 43.42,42.24 46.05,42.24 46.61,41.68 53.83,41.64 v54.11,41.32
  Bottom 0.127: v41.68,47.62 39.26,45.2 34.21,45.18 31.53,45.18 28.87,43.15 17.69,43.15 v17.45,43.2
DQ0X
  Top 0.127: IC3.K3 46.4,52.8 43.9,52.81 40.26,56.28 34.77,56.27 RN6.7
DQ1X
  Top 0.127: IC3.K4 46.4,52 43.32,52.01 41.05,54.28 RN7.8
DQ2X
  Top 0.127: IC3.L1 44.86,54 39.49,59.37 RN5.7
DQ3X
  Top 0.127: IC3.K5 46.39,51.21 42.77,51.21 42.28,51.72 RN7.5
DQ4X  (via drill 0.2)
  Top 0.127: IC3.J3 v47.2,52.8 | v39.55,57.67 38.33,57.67 RN5.5
  Bottom 0.127: v47.2,52.8 44.29,55.56 41.7,55.56 41.34,55.92 v39.55,57.67
DQ5X
  Top 0.127: IC3.L3 43.64,52.39 40.4,55.46 34.77,55.47 RN6.6
DQ6X
  Top 0.127: IC3.L4 43,51.61 41.2,53.41 RN7.7
DQ7X  (via drill 0.2)
  Top 0.127: IC3.J5 v47.2,51.2 | v39.37,52.6 RN7.6
  Bottom 0.127: v47.2,51.2 45.87,51.2 45.23,51.75 40.22,51.75 v39.37,52.6
DQKX
  Top 0.127: IC3.L2 44.15,53.19 40.06,57.11 34.78,57.12 RN6.8
DQRX  (via drill 0.2)
  Top 0.127: IC3.J4 v47.2,52 | v35.69,54.58 34.77,54.58 RN6.5
  Bottom 0.127: v47.2,52 46.23,51.99 43.48,54.57 v35.69,54.58
DS0X
  Top 0.127: IC3.K2 46.4,53.6 44.39,53.6 39.43,58.56 38.33,58.56 RN5.6
DS1X
  Top 0.127: IC3.J2 47.2,53.6 47.2,54.93 45.34,56.79 42.87,56.79 39.44,60.22 38.33,60.22 RN5.8
EN  (via drill 0.2)
  Top 0.127: T3.E39 70.87,51.27 71.5,51.9 75.87,51.89 v76.22,51.74
  Route15 0.127: v28.62,62.78 29.13,62.78 29.78,63.43 30.79,64.39 76.56,64.39 v77.6,63.42 77.94,63.12 77.96,52.64 v76.22,51.74 76.22,37.36 74.55,33.35 72.96,33.35 v72.53,33.78 71.88,34.43 25.6,34.43 24.11,32.94 22.98,32.94 v22.45,33.47 v22.44,33.47
  Bottom 0.127: T1.P$40 27.53,63.86 v28.62,62.78 | T2.P$40 22.46,33.49 v22.44,33.47 | 72.44,35.09 T5.P$40 72.53,35.01 v72.53,33.78 | T4.P$40 77.54,63.48 v77.6,63.42
FCK  (via drill 0.2)
  Top 0.127: IC3.B7 53.6,49.6 55.08,49.59 61.28,49.59 v61.62,49.93 | v71.25,49.92 72.81,49.92 T3.E13
  Bottom 0.127: v61.62,49.93 v71.24,49.93 v71.25,49.92
GND  (via drill 0.2, 0.3, 0.6)
  Top 0.15: RN8.2 14.18,49.42 14.26,49.51 14.26,50.92 14.3,50.96 14.3,51.18
  Top 0.3: IC3.G7 IC3.E5 IC3.E7 IC3.G5 | IC3.G5 | IC3.G5 49.19,49.3 49.21,49.28 49.23,49.28 v49.59,49.64
  Top 0.305: IC10.8 6.81,47.13 C34.1
  other vias: 43.13,44.29 43.15,45.18 61.71,44.2 60.22,44.36 49.6,50.36 50.4,50.36 50.41,49.62 67.52,40.91 58.51,55.9 59.19,56.45 6.29,52.36 8.96,52.31 6.17,57.83 8.9,57.86
  pour Top (rank 2): 0,100 100,100 100,0 0,0
  pour Bottom (rank 2): 0,100 100,100 100,0 0,0
  pour Route2 (rank 3): 0,0 0,100 100,100 100,0
GP1  (via drill 0.2)
  Top 0.15: T3.W31 v21.86,41.11 v21.85,41.12
  Bottom 0.15: v21.85,41.12 21.84,40.98 21.84,37.02 21.19,36.22 T2.P$41
GP2  (via drill 0.2)
  Top 0.15: T3.W20 30,58.89 29.41,59.13 29.41,63.07 29.71,63.84 28.83,63.84 v28.54,63.6
  Bottom 0.15: v28.54,63.6 28.81,63.87 T1.P$41
GP3  (via drill 0.2)
  Top 0.15: T3.E31 70.43,41.11 70.53,41.04 70.53,36.77 v70.47,36.79
  Bottom 0.15: v70.47,36.79 70.48,36.35 71.2,35.65 T5.P$41
GP4  (via drill 0.2)
  Top 0.15: T3.E20 79.38,58.89 v79.44,58.73
  Bottom 0.15: T4.P$41 78.79,64.91 78.79,62.93 79.46,62.26 v79.44,58.73
GPLL0  (via drill 0.2)
  Top 0.3: IC3.L6 v44.4,50
  Bottom 0.3: v44.4,50 44.85,50 C8.1 C9.1
GPLL1  (via drill 0.2)
  Top 0.3: IC3.C5 v52.8,50.4
  Bottom 0.3: v52.8,50.4 52.85,50.35 C3.1 54.5,50.35 C4.1
MX1  (via drill 0.2)
  Top 0.15: T3.W5 29.89,39.84 29.15,39.1 29.15,34.36 28.86,33.87 20.26,33.87 v19.9,33.71
  Bottom 0.15: v19.9,33.71 19.9,35.05 T2.P$42
MX2  (via drill 0.2)
  Top 0.15: T3.W6 29.34,41.11 28.7,40.47 21.58,40.47 v21.35,40.46
  Bottom 0.15: v21.35,40.46 21.19,40.16 T2.P$16
MX3  (via drill 0.2)
  Top 0.15: T3.W30 20.11,39.84 v19.87,40.08
  Bottom 0.15: v19.87,40.08 19.87,38.94 T2.P$17
MX4  (via drill 0.2)
  Top 0.15: T3.W21 30.34,60.16 v29.81,59.56
  Bottom 0.15: v29.81,59.56 30.08,59.9 T1.P$17
MX5  (via drill 0.2)
  Top 0.15: T3.W46 28.47,60.16 v28.68,59.86
  Bottom 0.15: v28.68,59.86 28.68,61.05 T1.P$16
MX6  (via drill 0.2)
  Top 0.15: T3.W45 28.69,58.89 29.08,59.41 29.09,60.19 v29.08,63.41
  Bottom 0.15: v29.08,63.41 29.76,63.41 30.05,63.75 30.05,64.89 T1.P$42
MX7  (via drill 0.2)
  Top 0.15: T3.E5 72.01,39.84 v71.73,40.41
  Bottom 0.15: v71.73,40.41 71.73,37.82 69.98,37.06 69.96,35.12 T5.P$42
MX8  (via drill 0.2)
  Top 0.15: T3.E6 v71.69,41.11
  Bottom 0.15: v71.69,41.11 71.19,40.56 T5.P$16
MX9  (via drill 0.2)
  Top 0.15: T3.E30 69.95,39.84 v70.13,40.46
  Bottom 0.15: v70.13,40.46 69.92,39.81 T5.P$17
MX10  (via drill 0.2)
  Top 0.15: T3.E21 78.04,60.16 78.57,59.48 79.66,59.48 v80.06,59.83
  Bottom 0.15: v80.06,59.83 T4.P$17
MX11  (via drill 0.2)
  Top 0.15: T3.E46 70.76,60.16 71.46,60.76 74.55,60.76 74.84,60.52 78.33,60.51 78.82,60.02 v78.86,59.88
  Bottom 0.15: v78.86,59.88 78.86,61.16 T4.P$16
MX12  (via drill 0.2)
  Top 0.15: T3.E45 71.06,58.89 71.68,59.51 78.04,59.52 78.33,59.2 80.16,59.19 v80.69,59.81
  Bottom 0.15: T4.P$42 80.09,62.74 80.69,62.14 v80.69,59.81
N$1  (via drill 0.4)
  Top 0.305: IC10.13 4.35,49.72 v4.58,49.85 4.85,49.72 IC10.12
  Top 0.406: 8.06,48.33 D3.A 7.82,49.15 | C34.2 v7.01,49.15
  Top 0.61: v7.01,49.15 7.82,49.15
  Bottom 0.61: v4.58,49.85 6.23,49.85 v7.01,49.15
N$2
  Top 0.15: RN1.3 11.74,42.3 11.25,42.79 4.24,42.78 4.24,22.54 3.63,22.17 L3.G
N$3  (3 unrouted)
  Top 0.406: C25.2 2.87,59.69 U$1.P$3
N$4
  Top 0.15: RN1.2 11.53,43.09 11.23,43.21 3.59,43.2 L3.R
N$6
  Top 0.15: L3.B 2.77,21.79 3.01,21.54 4.84,21.56 4.83,42.36 11.06,42.33 11.96,41.43 RN1.4
N$8  (via drill 0.2)
  Top 0.127: RN23.6 57.99,65.11 60.48,67.59 68.35,67.6 v69.16,66.84
  Bottom 0.127: v69.16,66.84 69.16,63.03 68.64,62.56 68.62,61.15 T4.P$8
N$9  (via drill 0.2)
  Top 0.127: RN23.5 58.87,65.24 60.58,66.95 68.07,66.95 v68.66,66.36
  Bottom 0.127: v68.66,66.36 68.66,64.94 T4.P$33
N$15  (via drill 0.2)
  Top 0.127: RN23.8 56.32,65.45 59.94,69.07 69.42,69.07 v70.5,67.99
  Bottom 0.127: v70.5,67.99 70.5,63.13 69.91,62.54 T4.P$9
N$16  (via drill 0.2)
  Top 0.127: RN23.7 57.2,65.19 60.38,68.37 68.91,68.36 v69.91,67.35
  Bottom 0.127: v69.91,67.35 T4.P$34
N$17  (via drill 0.2)
  Top 0.127: RN22.6 54.66,66.08 59.05,70.47 70.71,70.47 v71.78,69.4
  Bottom 0.127: v71.78,69.4 71.78,63.21 71.17,62.6 71.17,61.13 T4.P$10
N$18
  Top 0.15: R3.1 12.18,53.25 C7.1 13.18,51.52 RN8.4 14.5,52 IC2.5
N$19
  Top 0.406: IC2.3 17.55,53.9 18.94,55.29 19.96,55.29 L2.P$1
N$20  (via drill 0.2)
  Top 0.127: RN22.5 55.53,65.67 59.54,69.67 70.19,69.67 v71.19,68.67
  Bottom 0.127: v71.19,68.67 T4.P$35
N$21  (via drill 0.2)
  Top 0.127: RN22.8 52.98,67.09 58.08,72.19 71.58,72.19 v73.11,70.66
  Bottom 0.127: v73.11,70.66 73.11,63.23 72.47,62.59 T4.P$11
N$22  (via drill 0.2)
  Top 0.127: RN22.7 53.86,66.63 58.61,71.38 71.1,71.38 v72.5,69.98
  Bottom 0.127: v72.5,69.98 72.5,64.97 T4.P$36
N$23  (via drill 0.2)
  Top 0.127: RN21.6 51.6,68.32 57,73.72 72.46,73.72 v74.33,71.85
  Bottom 0.127: v74.33,71.85 74.33,63.28 73.7,62.65 73.7,61.15 T4.P$12
N$24  (via drill 0.2)
  Top 0.127: RN21.5 52.48,68.03 57.42,72.97 71.89,72.97 v73.72,71.14
  Bottom 0.127: v73.72,71.14 73.72,64.94 T4.P$37
N$25  (via drill 0.2)
  Top 0.127: RN21.8 49.92,62.59 50.05,62.71 50.05,69.17 56.15,75.4 73.74,75.4 v75.69,73.4
  Bottom 0.127: v75.69,73.4 75.69,63.25 74.99,62.48 T4.P$13
N$26  (via drill 0.2)
  Top 0.127: RN21.7 50.8,68.7 56.63,74.53 73.03,74.53 v74.99,72.57
  Bottom 0.127: v74.99,72.57 74.99,64.94 T4.P$38
N$27  (via drill 0.2)
  Top 0.127: RN17.8 46.9,67.69 41.53,73.06 21.41,73.06 v19.2,70.85
  Bottom 0.127: v19.2,70.85 19.2,63.5 19.93,62.77 T1.P$9
N$28  (via drill 0.2)
  Top 0.127: RN17.6 48.58,68.19 42.13,74.63 21.18,74.63 v17.98,71.39
  Bottom 0.127: v17.98,71.39 17.98,63.43 18.66,62.78 T1.P$8
N$29  (via drill 0.2)
  Top 0.127: RN17.7 47.77,67.86 41.89,73.74 21.3,73.72 v19.9,72.36
  Bottom 0.127: v19.9,72.36 T1.P$34
N$30  (via drill 0.2)
  Top 0.127: RN17.5 49.45,68.75 42.61,75.59 20.32,75.59 v18.59,73.86
  Bottom 0.127: v18.59,73.86 18.59,64.98 T1.P$33
N$31  (via drill 0.2)
  Top 0.127: RN16.8 43.78,66.05 40.04,69.79 23.57,69.72 v21.83,67.87
  Bottom 0.127: v21.83,67.87 21.83,63.54 22.47,62.94 T1.P$11
N$32  (via drill 0.2)
  Top 0.127: RN16.6 45.45,66.84 40.89,71.41 22.48,71.34 v20.62,69.48
  Bottom 0.127: v20.62,69.48 20.62,63.45 21.19,62.88 T1.P$10
N$33  (via drill 0.2)
  Top 0.127: RN16.5 46.33,67.02 41.18,72.17 22.1,72.1 v21.17,71.17
  Bottom 0.127: v21.17,71.17 21.17,64.94 T1.P$35
N$34  (via drill 0.2)
  Top 0.127: RN16.7 44.66,66.31 40.33,70.63 23.38,70.56 v22.46,69.64
  Bottom 0.127: v22.46,69.64 T1.P$36
N$35  (via drill 0.2)
  Top 0.127: RN15.8 40.68,65.62 39.2,67.1 26.24,67.08 v25.71,67.08
  Bottom 0.127: v25.71,67.08 25.69,63.52 25.01,62.84 T1.P$13
N$36  (via drill 0.2)
  Top 0.127: RN15.6 42.35,65.36 39.35,68.37 23.74,68.3 v23.05,67.61
  Bottom 0.127: v23.05,67.61 23.05,63.56 23.74,62.87 T1.P$12
N$37  (via drill 0.2)
  Top 0.127: RN15.7 41.55,65.44 39.3,67.69 24.95,67.62 v23.73,66.4
  Bottom 0.127: v23.73,66.4 T1.P$37
N$38  (via drill 0.2)
  Top 0.127: RN15.5 43.23,65.64 39.76,69.11 25.03,69.04 v24.98,69.09
  Bottom 0.127: v24.98,69.09 24.98,64.94 T1.P$38
N$39  (via drill 0.2)
  Top 0.127: RN26.3 55.3,33.76 59.11,29.95 80.48,29.97 v80.68,30.25
  Bottom 0.127: v80.68,30.25 80.68,36.54 80.1,37.17 80.1,38.87 T5.P$9
N$40  (via drill 0.2)
  Top 0.127: RN26.1 53.62,33.6 58.51,28.72 81.98,28.72 v82.02,28.81
  Bottom 0.127: v82.02,28.81 82.02,36.59 81.33,37.29 81.33,38.87 T5.P$8
N$41  (via drill 0.2)
  Top 0.127: RN26.4 56.17,33.88 59.32,30.74 v80.06,30.74 v80.07,30.75
  Bottom 0.127: v80.07,30.75 80.07,35.06 T5.P$34
N$42  (via drill 0.2)
  Top 0.127: RN26.2 54.5,33.57 58.79,29.34 81.11,29.34 v81.32,29.39
  Bottom 0.127: v81.32,29.39 81.32,35.05 T5.P$33
N$43  (via drill 0.2)
  Top 0.127: RN25.3 58.4,34.19 59.87,32.72 78.17,32.72 v78.19,32.82
  Bottom 0.127: v78.19,32.82 78.19,36.49 77.56,37.09 77.56,38.87 T5.P$11
N$44  (via drill 0.2)
  Top 0.127: RN25.1 56.73,34.17 59.51,31.39 79.56,31.39 v79.45,31.37
  Bottom 0.127: v79.45,31.37 79.45,36.37 78.82,36.96 T5.P$10
N$45  (via drill 0.2)
  Top 0.127: RN25.4 59.27,34.02 60.04,33.25 77.52,33.25 v77.56,33.29
  Bottom 0.127: v77.56,33.29 77.56,35.05 T5.P$36
N$46  (via drill 0.2)
  Top 0.127: RN25.2 57.6,34.14 59.68,32.06 v78.77,32.06 v78.78,32.07
  Bottom 0.127: v78.78,32.07 78.78,35.05 T5.P$35
N$47  (via drill 0.2)
  Top 0.127: RN24.3 52.2,33.05 57.94,27.31 75.62,27.31 v75.67,27.26
  Bottom 0.127: v75.67,27.26 75.67,36.22 75.02,36.87 75.02,38.87 T5.P$13
N$48  (via drill 0.2)
  Top 0.127: RN24.1 50.52,32.91 57.53,25.9 76.98,25.9 v76.92,25.92
  Bottom 0.127: v76.92,25.92 76.93,36.29 76.26,37.1 76.25,38.87 T5.P$12
N$49  (via drill 0.2)
  Top 0.127: RN24.4 53.08,33.09 58.18,27.98 74.97,27.98 v74.99,28
  Bottom 0.127: v74.99,28 74.99,35.06 T5.P$38
N$50  (via drill 0.2)
  Top 0.127: RN24.2 51.4,32.87 57.75,26.52 76.31,26.52 v76.33,26.54
  Bottom 0.127: v76.33,26.54 76.33,35.02 T5.P$37
N$51  (via drill 0.2)
  Top 0.127: RN20.3 42.77,33.84 41.26,32.33 31.15,32.33 v30.7,32.74
  Bottom 0.127: v30.7,32.74 30.7,36.84 30.08,37.5 T2.P$9
N$52  (via drill 0.2)
  Top 0.127: RN20.1 41.1,33.83 40.64,33.37 32.07,33.37 v32,33.3
  Bottom 0.127: v32,33.3 32,36.7 31.35,37.35 T2.P$8
N$53  (via drill 0.2)
  Top 0.127: RN20.4 43.65,33.84 41.62,31.81 30.62,31.81 v30.11,32.32
  Bottom 0.127: v30.11,32.32 30.11,35.05 T2.P$34
N$54  (via drill 0.2)
  Top 0.127: RN20.2 41.98,34.02 40.93,32.8 31.81,32.81 v31.37,32.99
  Bottom 0.127: v31.37,32.99 31.37,35.05 T2.P$33
N$55  (via drill 0.2)
  Top 0.127: RN19.3 49.1,32.53 43.63,27.32 28.32,27.32 v28.19,27.43
  Bottom 0.127: v28.19,27.43 28.19,36.64 27.55,37.42 T2.P$11
N$56  (via drill 0.2)
  Top 0.127: RN19.1 47.42,32.9 42.99,28.46 29.68,28.47 v29.49,28.73
  Bottom 0.127: v29.49,28.73 29.49,36.48 28.82,37.36 T2.P$10
N$57  (via drill 0.2)
  Top 0.127: RN19.4 49.98,32.51 43.86,26.59 27.68,26.59 v27.62,26.68
  Bottom 0.127: v27.62,26.68 27.61,35.01 T2.P$36
N$58  (via drill 0.2)
  Top 0.127: RN19.2 48.3,32.56 43.35,27.86 28.85,27.86 v28.84,27.99
  Bottom 0.127: v28.84,27.99 28.82,35.06 T2.P$35
N$59  (via drill 0.2)
  Top 0.127: RN18.3 45.97,33.53 42.3,29.86 27.38,29.86 v25.66,31.58
  Bottom 0.127: v25.66,31.58 25.66,36.88 25.01,37.53 T2.P$13
N$60  (via drill 0.2)
  Top 0.127: RN18.1 44.3,33.55 41.87,31.13 28.4,31.13 v27.02,32.51
  Bottom 0.127: v27.02,32.51 27.02,36.52 26.3,37.24 26.3,38.85 T2.P$12
N$61  (via drill 0.2)
  Top 0.127: RN18.4 46.84,33.33 42.77,29.25 26.86,29.25 v25.07,31.04
  Bottom 0.127: v25.07,31.04 25.07,35.01 T2.P$38
N$62  (via drill 0.2)
  Top 0.127: RN18.2 45.17,33.64 42.07,30.54 27.92,30.54 v26.27,32.19
  Bottom 0.127: v26.27,32.19 T2.P$37
N$93
  Top 0.15: RN8.7 12.38,49.42 12.84,48.83 13.18,48.83 RN8.1 13.18,48.12 C6.1 14.03,47.52 IC1.5
N$94
  Top 0.406: IC1.3 18.23,48.62 18.91,49.3 20.02,49.3 L1.P$1
PEN
  Top 0.127: IC1.1 16.65,46.15 C5.1 16.62,45.37 RN1.8
PRT  (via drill 0.2)
  Top 0.127: IC3.L9 v42.47,47.6 v42.46,47.59 | v54.06,42.12 54.24,41.96 54.68,41.52 v66.42,41.47 | v70.63,48.85 70.63,49.77 70.41,49.99 T3.E38
  Route15 0.127: v42.46,47.59 42.46,43.87 43.69,42.63 46.96,42.62 47.1,42.76 53.4,42.77 v54.06,42.12
  Bottom 0.127: v66.42,41.47 69.91,41.46 70.66,42.6 v70.63,48.85
RESET  (via drill 0.2)
  Route15 0.127: v22.47,37.51 23.8,37.51 24.58,36.38 v71.35,36.38 | v22.43,41.53 16.27,41.52 10.97,46.74 10.97,59.05 13.22,62.02 25.7,62 28.67,61.99 76.89,62.02 v77.55,62.46
  Route15 0.15: v25.75,62.53 25.7,62.48 25.7,62
  Bottom 0.127: v22.47,37.51 T2.P$15 22.46,41.5 v22.43,41.53 | v71.35,36.38 71.78,36.97 72.46,37.65 T5.P$15 | T1.P$15 27.54,62.38 | v77.55,62.46 T4.P$15
  Bottom 0.15: 27.54,62.38 27.24,62.68 25.9,62.68 v25.75,62.53
SCK
  Top 0.127: RN11.3 32.64,43.85 32.15,44.34 29.29,44.34 28.58,43.63 27.18,43.63 T3.W33
SCL  (via drill 0.2)
  Top 0.127: T3.E32 70.26,42.38 70.88,42.12 | 70.88,42.12 70.88,35.29 71.2,34.75 71.48,34.23 73.74,34.23 v73.74,33.8 | IC10.6 4.85,45.85 5.02,45.68 5.37,45.68 v5.43,45.62 | RN27.7 78.49,49.64 77.91,49.06 77.91,45.21 77.05,44.35 74.66,44.35 74.16,44 74.16,43.24 73.9,43.01 71.77,43.01 70.88,42.12
  Route15 0.127: v23.77,33.44 25.16,34.89 73.19,34.89 73.74,34.34 v73.74,33.8
  Bottom 0.127: T2.P$39 23.72,33.49 v23.77,33.44 22.35,32.02 18.41,32.02 17.94,32.49 17.94,40.16 16.6,41.5 15.32,41.5 11.2,45.62 v5.43,45.62 | v73.74,33.8 v73.73,33.81 T5.P$39
SCL2  (via drill 0.2)
  Top 0.127: T3.E44 70.68,57.62 71.27,58.21 73.91,58.21 v75.62,58.43 v75.63,58.44 76.79,58.44 79.17,56.06 RN27.5
  Route15 0.127: v25.86,63.11 27.38,64.98 76.18,65.06 76.17,66.17 v76.21,66.21
  Bottom 0.127: T1.P$39 26.26,63.51 v25.86,63.11 | v75.62,58.43 75.6,62.45 76.24,63.11 76.25,64.94 T4.P$39 76.21,64.98 v76.21,66.21
SDA  (via drill 0.2)
  Top 0.127: IC10.7 5.94,46.33 v5.97,46.3 | RN27.8 79.17,45.81 77.37,44.01 74.8,44.01 74.46,43.75 v74.46,42.79 74.05,42.38 T3.E7
  Route15 0.127: v23.73,36.55 24.36,35.69 74.09,35.69 v74.28,37.4
  Bottom 0.127: v23.73,36.55 T2.P$14 23.73,41.23 23.18,41.92 15.49,41.92 10.97,46.3 v5.97,46.3 | v74.28,37.4 73.99,37.4 73.69,37.7 73.69,38.84 T5.P$14 73.73,42.06 v74.46,42.79
SDA2  (via drill 0.2)
  Top 0.127: T3.E19 74.16,57.62 v76.26,58 78.03,56.23 78.03,50.9 78.49,50.44 RN27.6
  Route15 0.127: v25.25,59.29 27.1,61.58 74.99,61.58 76.27,59.74 v76.26,58
  Bottom 0.127: T1.P$14 26.27,60.31 v25.25,59.29 | v76.26,58 T4.P$14
SI
  Top 0.127: RN11.2 32.58,44.65 32.32,44.91 T3.W9
SO
  Top 0.127: RN11.1 29.14,45.52 28.54,44.93 27.18,44.93 T3.W34
TB0
  Top 0.127: IC3.B1 53.2,55.1 57.99,59.12 RN23.3
TB1
  Top 0.127: IC3.B2 53.6,53.6 53.6,54.69 58.87,59.19 RN23.4
TB2  (via drill 0.2)
  Top 0.127: IC3.C4 52,52 v52,52.76 | v56.32,58.94 RN23.1
  Bottom 0.127: v52,52.76 53,53.73 53,56.39 v56.32,58.94
TB3  (via drill 0.2)
  Top 0.127: IC3.C3 v52.8,52.8 | v57.18,58.98 57.18,59.71 RN23.2
  Bottom 0.127: v52.8,52.8 53.6,53.6 53.6,56.17 v57.18,58.98
TB4
  Top 0.127: IC3.C2 52.8,53.6 52.8,56.98 54.63,58.55 54.63,63.32 RN22.3
TB5  (via drill 0.2)
  Top 0.127: IC3.C1 52.4,57.17 v53.89,58.66 | v55.54,59.47 RN22.4
  Bottom 0.127: v53.89,58.66 54.73,58.66 v55.54,59.47
TB6  (via drill 0.2)
  Top 0.127: IC3.E1 v50.8,56.55 v50.81,56.56 | v53,62.43 53,63.34 RN22.1
  Bottom 0.127: v50.81,56.56 50.81,60.01 v53,62.43
TB7  (via drill 0.2)
  Top 0.127: IC3.D1 51.6,57.49 v51.53,57.56 | v53.86,61.14 RN22.2
  Bottom 0.127: v51.53,57.56 51.53,58.81 v53.86,61.14
TB8
  Top 0.127: IC3.D2 52,53.6 52,57.74 51.59,58.15 51.59,59.72 RN21.3
TB9  (via drill 0.2)
  Top 0.127: IC3.D3 v51.2,52.8 | v52.48,58.85 RN21.4
  Bottom 0.127: v51.2,52.8 52.2,53.8 52.2,58.57 v52.48,58.85
TB10
  Top 0.127: IC3.E2 51.2,53.6 51.2,56.82 49.93,58.09 RN21.1
TB11  (via drill 0.2)
  Top 0.127: IC3.E3 v50.4,52.8 | v50.38,58.47 50.8,58.89 RN21.2
  Bottom 0.127: v50.4,52.8 50.2,53 50.2,58.29 v50.38,58.47
TC0
  Top 0.127: IC3.F1 50,56.27 48.59,57.68 48.59,63.38 RN17.3
TC1
  Top 0.127: IC3.F2 50.4,53.6 50.4,56.37 49.25,57.76 49.25,61.86 49.46,62.07 RN17.4
TC2  (via drill 0.2)
  Top 0.127: IC3.F4 v49.6,51.99 | v46.91,62.58 v46.9,62.59 RN17.1
  Bottom 0.127: v49.6,51.99 49.6,52.04 49.59,58.5 46.9,61.16 v46.91,62.58
TC3
  Top 0.127: IC3.F3 49.6,52.8 49.6,56.08 47.78,57.9 RN17.2
TC4  (via drill 0.2)
  Top 0.127: IC3.G1 49.2,55.6 47.12,57.68 v47.12,58.46 | v45.46,58.9 RN16.3
  Bottom 0.127: v47.12,58.46 45.9,58.46 v45.46,58.9
TC5
  Top 0.127: IC3.G2 48.8,53.6 48.8,55.6 46.33,58.07 RN16.4
TC6  (via drill 0.2)
  Top 0.127: IC3.G3 v48.8,52.8 | v43.77,58.79 v43.78,58.8 RN16.1
  Bottom 0.127: v48.8,52.8 48.79,55.42 48.79,57.93 48.66,58.06 47.08,59.69 44.23,59.69 v43.77,58.79
TC7  (via drill 0.2)
  Top 0.127: IC3.H3 v48,52.8 | v44.66,58.86 v44.66,58.87 RN16.2
  Bottom 0.127: v48,52.8 48,55.47 44.66,58.81 v44.66,58.86
TC8
  Top 0.127: IC3.H1 48.4,55.4 45.61,58.19 43.69,58.19 42.35,59.52 RN15.3
TC9
  Top 0.127: IC3.H2 48,53.6 48,55.28 45.49,57.79 43.63,57.79 41.57,59.85 41.57,63.38 RN15.2
TC10
  Top 0.127: IC3.J1 47.59,55.04 47.59,55.26 45.43,57.42 43.08,57.42 40.7,59.8 40.7,63.38 RN15.1
TC11  (via drill 0.2)
  Top 0.127: IC3.K1 46.8,54.73 45.24,56.29 v43.21,56.29 | v43.2,62.45 43.2,63.37 RN15.4
  Bottom 0.127: v43.21,56.29 v43.21,62.44 v43.2,62.45
TF0  (via drill 0.2)
  Top 0.127: IC3.A9 54.64,47.6 v54.66,47.62 | v53.63,37.54 RN26.8
  Route15 0.127: v54.66,47.62 54.66,38.98 54.06,38.38 54.07,37.9 v53.63,37.54
TF1  (via drill 0.2)
  Top 0.127: IC3.C8 52,48 v52.01,46.44 | v54.51,37.62 RN26.7
  Bottom 0.127: v52.01,46.44 52.02,44.74 52.03,42.82 54.52,40.33 v54.51,37.62
TF2  (via drill 0.2)
  Top 0.127: IC3.A8 55.1,48.4 v55.05,48.39 | v55.3,37.67 RN26.6
  Route15 0.127: v55.05,48.39 55.06,37.86 v55.3,37.67
TF3  (via drill 0.2)
  Top 0.127: IC3.C7 v52.8,48.8 | 56.16,36.77 RN26.5 v56.17,37.57
  Route15 0.127: v52.8,48.8 55.27,48.79 55.51,48.54 55.52,38.22 v56.17,37.57
  Bottom 0.127: v56.17,37.57 v56.16,37.56
TF4  (via drill 0.2)
  Top 0.127: IC3.A6 55.39,50 v55.81,49.99 | v56.73,40.65 RN25.8
  Route15 0.127: v55.81,49.99 55.8,41.99 v56.73,40.65
TF5  (via drill 0.2)
  Top 0.127: IC3.A5 v56.21,50.8 | v57.59,40.66 RN25.7
  Route15 0.127: v56.21,50.8 56.21,42.44 v57.59,40.66
TF6  (via drill 0.2)
  Top 0.127: IC3.A2 56.14,53.2 v56.61,53.17 | v58.41,40.63 RN25.6
  Route15 0.127: v56.61,53.17 56.61,42.87 v58.41,40.63
TF7  (via drill 0.2)
  Top 0.127: IC3.A3 v57.03,52.4 | v59.26,40.58 RN25.5
  Route15 0.127: v57.03,52.4 57.02,43.06 v59.26,40.58
TF8
  Top 0.127: IC3.F11 50,40.97 50.51,40.46 50.51,39.77 RN24.8
TF9  (via drill 0.2)
  Top 0.127: IC3.E9 v50.4,47.2 | v51.4,40.75 RN24.7
  Bottom 0.127: v50.4,47.2 50.6,47 50.61,44.06 50.61,41.54 v51.4,40.75
TF10
  Top 0.127: IC3.E10 50.4,46.4 50.4,42.35 52.19,40.56 RN24.6
TF11  (via drill 0.2)
  Top 0.127: IC3.E8 v50.4,47.99 | v52.92,40.66 53.08,40.58 RN24.5
  Bottom 0.127: v50.4,47.99 50,47.6 50.01,43.65 50.01,41.46 51.1,40.37 52.72,40.37 52.99,40.64 v52.92,40.66
TG0
  Top 0.127: IC3.K11 46.8,42.92 46.56,42.68 43.5,42.68 41.08,40.26 41.08,36.77 RN20.8
TG1  (via drill 0.2)
  Top 0.127: IC3.H10 48,46.4 48,42.12 47.63,41.81 v44.72,41.81 | v41.95,37.51 41.95,36.77 RN20.7
  Bottom 0.127: v44.72,41.81 43.28,41.79 41.97,40.36 41.97,37.53 v41.95,37.51
TG2
  Top 0.127: IC3.J10 47.2,46.4 47.19,43.45 47.19,42.59 46.96,42.23 44.38,42.23 42.77,40.45 RN20.6
TG3  (via drill 0.2)
  Top 0.127: IC3.G8 48.82,48.02 v48.82,48 | v43.63,37.67 43.65,37.65 RN20.5
  Bottom 0.127: v48.82,48 48.4,47.58 48.39,42.39 47.11,41.41 44.38,41.41 43.63,40.34 v43.63,37.67
TG4
  Top 0.127: IC3.H11 48.4,38.63 47.41,37.64 47.41,36.77 RN19.8
TG5
  Top 0.127: IC3.G10 48.8,46.4 48.8,38.19 48.29,37.68 RN19.7
TG6  (via drill 0.2)
  Top 0.127: IC3.D9 v51.2,47.2 | v49.1,37.62 RN19.6
  Bottom 0.127: v51.2,47.2 51,47 50.99,44.09 50.99,43.27 53.36,40.88 53.36,38.49 52.85,38.01 49.45,38.01 v49.1,37.62 v49.1,37.61
TG7  (via drill 0.2)
  Top 0.127: IC3.E11 50.8,42.47 52.11,41.16 53.09,41.16 53.72,40.53 v53.78,40.51 | v49.97,37.6 RN19.5
  Bottom 0.127: v53.78,40.51 53.78,38.42 52.91,37.6 v49.97,37.6
TG8  (via drill 0.2)
  Top 0.127: IC3.G9 v48.8,47.2 | v44.3,40.52 RN18.8
  Bottom 0.127: v48.8,47.2 48.8,42.18 47.5,41.13 44.73,41.13 v44.3,40.52
TG9  (via drill 0.2)
  Top 0.127: IC3.G11 v49.19,40.87 | v45.18,40.49 RN18.7
  Bottom 0.127: v49.19,40.87 45.45,40.87 v45.18,40.49
TG10  (via drill 0.2)
  Top 0.127: IC3.F10 49.6,46.4 49.62,40.57 v49.22,40.29 | v45.97,40.48 RN18.6
  Bottom 0.127: v49.22,40.29 46.07,40.29 v45.97,40.48
TG11  (via drill 0.2)
  Top 0.127: IC3.F9 v49.6,47.2 | 46.85,39.74 RN18.5 v47.65,39.75
  Bottom 0.127: v49.6,47.2 49.2,46.71 49.2,41.73 49.19,41.54 49.64,41.1 49.63,39.93 49.47,39.74 48,39.74 v47.65,39.75
VB1+  (via drill 0.3)
  Top 0.8: T3.W25 30.98,65.84 30.37,66.45 26.41,66.45 25.05,65.09 7.88,65.09 D2.C
  Bottom 0.8: 83.85,65.49 83.85,68.53 77.55,74.83 42.14,74.83 40.21,72.9 40.21,64.95 T1.P$50
  other vias: 32.75,63.36 32.75,62.7 33.47,63.36 33.45,62.69 34.19,63.35 34.19,62.72 34.93,63.35 34.92,62.72 86.3,62.64 86.3,63.3 85.58,62.64 85.6,63.31 84.86,62.65 84.86,63.28 84.12,62.65 84.13,63.28
  pour Bottom: 29.88,66.36 40.85,66.36 40.85,60.04 29.87,60.04 29.87,66.37
  pour Top: 29.84,66.59 35.93,66.51 35.93,60.63 29.6,60.69 29.6,66.54
  pour Bottom: 83.4,66.2 91.06,66.22 91.07,59.84 83.19,59.82 83.19,66.2
  pour Top: 71.95,66.22 87.14,66.22 87.16,60.81 71.59,60.83 71.57,66.21
VB2+  (via drill 0.3)
  Top 0.8: D1.C 10.05,39.87 T2.P$24 T2.P$22
  Bottom 0.8: T5.P$50 59.76,33.91 51.96,25.9 19.1,25.9 14.88,30.33 14.88,35.03 T2.P$46
  other vias: 16.02,36.63 16.02,37.29 15.3,36.63 15.32,37.3 14.58,36.64 14.58,37.27 13.84,36.64 13.85,37.27 67.25,36.87 67.25,37.53 66.53,36.87 66.55,37.54 65.81,36.88 65.81,37.51 65.07,36.88 65.08,37.51
  pour Bottom: 9.23,40.2 16.89,40.22 16.89,33.83 9.01,33.81 9.01,40.21
  pour Top: 13.08,39.24 28.52,39.23 28.62,33.93 13.03,33.93 13.03,39.18
  pour Top: 70.16,33.64 64.07,33.72 64.11,38.09 70.44,38.03 70.4,33.69
  pour Bottom: 70.12,33.87 59.07,33.87 59.07,40.19 70.13,40.19 70.13,33.86
VBUS  (via drill 0.2)
  Top 0.127: IC10.2 v2.55,47.63 | v10.05,48.38 10.05,48.18 | 10.05,48.18
  Top 0.8: U$2.P$2 8.62,69.12 6,66.5 6,61.98 6.33,61.65 7.52,61.65 D2.A
  Top 0.813: D2.A 7.54,61.66 10.02,59.97 10.02,56.96 9.5,56.65 U$1.VBUS@1 6.1,56.62 5.7,56.22 5.7,53.95 6.06,53.59 U$1.VBUS@2 9.51,53.56 10.04,52.98 v10.05,48.38 10.05,48.18 D1.A
  Bottom 0.127: v2.55,47.63 2.55,47.66 3.63,48.74 6.23,48.74 6.63,48.34 10.01,48.34 v10.05,48.38
VCC  (via drill 0.2, 0.3)
  Top 0.15: RN8.8 12.1,47.6 C6.2
  Top 0.17: 48.78,51.2 51.24,51.2
  Top 0.2: IC3.H4 48.78,51.2 | 51.24,51.2 51.6,51.58 IC3.D4
  Top 0.3: IC3.H8 v48,48 | IC3.D4 v51.2,52 | IC3.D8 v51.2,48 | R1.1 59.65,50.2 v60.17,50.2 | R2.2 39.2,50.25 v39.26,50.26
  Top 0.406: C6.2 12.18,46.77 v12.21,46.73 | T3.E4 74.07,38.56 74.41,39.25 74.4,41.72 v74.62,41.97
  Route15 0.3: v60.17,50.2 60.37,50.19 | v39.26,50.26 39.18,50.26
  Route15 0.406: v74.62,41.97 61.57,42.02 61,43.44 | v12.21,46.73 17.22,46.73 v18.63,45.32
  Bottom 0.3: C21.2 48.14,48.22 v48,48 | C18.2 50.89,48.2 v51.2,48 | C24.2 v51.2,52
  other vias: 19.6,45.32 20.66,45.31 21.61,45.32 19.06,44.64 20.11,44.64 21.15,44.66
  pour Top: 24.2,47.51 24.18,44.22 17.73,44.22 17.75,47.52 18.2,47.55
  pour Route15: 18.07,56.84 61.23,56.98 61.23,43.25 18.07,43.11
VPLL0  (via drill 0.2, 0.3)
  Top 0.3: IC3.J6 v47.2,50.4 | R2.1 41.92,50.25 v42.02,50.15
  Bottom 0.3: v47.2,50.4 46.6,50.2 C8.2 | C9.2 C8.2 | v42.02,50.15 42.74,50.87 45.53,50.87 46.05,50.35 C8.2
VPLL1  (via drill 0.2, 0.3)
  Top 0.3: IC3.C6 v52.8,49.6 | v57.51,50.2 57.9,50.2 R1.2
  Bottom 0.3: v52.8,49.6 53.05,49.35 C3.2 54.5,49.35 C4.2 56.55,49.38 v57.51,50.2
~!HB
  Top 0.127: IC3.L5 42.56,50.82 42.16,51.21 36.28,51.21 35.55,51.89 34.76,51.89 RN12.8
~!INT  (via drill 0.2)
  Top 0.127: IC3.J11 47.59,42.47 v47.5,42.22 | v39.78,41.45 38.27,41.45 RN14.7
  Bottom 0.127: v47.5,42.22 40.6,42.23 v39.78,41.45
~!LB
  Top 0.127: IC3.K6 46.4,50.4 42.47,50.39 41.94,50.91 35.74,50.9 35.54,51.01 34.77,51.01 RN12.7
~!OE
  Top 0.127: IC3.B6 53.6,50.4 56.44,50.38 56.89,50.83 62.62,50.84 63.27,51.02 RN4.6
~!SS
  Top 0.127: IC3.K10 46.4,46.4 42.57,46.4 39.14,42.97 34.76,42.97 RN11.5
~!WE  (via drill 0.2)
  Top 0.127: IC3.D7 51.69,49.2 52.01,49.52 v52,50.4 | v63.14,51.9 RN4.5
  Bottom 0.127: v63.14,51.9 62.38,51.18 56.11,51.19 53.77,51.2 52.93,50.8 52.6,50.8 52.2,50.4 v52,50.4
~A4
  Top 0.127: IC3.J7 47.2,48.8 39.44,48.8 39.27,48.63 RN13.8
~A5  (via drill 0.2)
  Top 0.127: IC3.H7 48.4,49.4 48.2,49.6 v47.2,49.6 | v39.32,47.75 38.27,47.75 RN13.7
  Bottom 0.127: v47.2,49.6 47.19,49.54 46.42,48.74 40.24,48.74 v39.32,47.75
~A6
  Top 0.127: IC3.K7 46.4,49.6 36.19,49.6 35.59,50.2 34.77,50.2 RN12.6
~A7  (via drill 0.2)
  Top 0.127: IC3.J8 v47.2,48 | v39.32,46.1 RN13.5
  Bottom 0.127: v47.2,48 41.22,48 v39.32,46.1
~A8
  Top 0.127: IC3.L7 35.93,49.2 35.78,49.35 RN12.5
~A9
  Top 0.127: IC3.L8 40.84,48.4 39.39,46.95 38.27,46.95 RN13.6
~A10  (via drill 0.2)
  Top 0.127: IC3.H9 v48,47.2 | v39.5,42.35 v39.49,42.34 RN14.8
  Bottom 0.127: v48,47.2 47.87,46.39 43.55,46.4 v39.5,42.35
~D0
  Top 0.127: IC3.B11 53.2,45.4 53.4,45.2 60.11,45.2 60.66,44.65 RN10.5
~D1
  Top 0.127: IC3.A11 60.18,46 60.58,45.6 RN9.8
~D2
  Top 0.127: IC3.A10 55.08,46.79 60.21,46.79 60.51,46.49 RN9.7
~D3
  Top 0.127: IC3.B9 53.6,48 60.06,48 60.28,48.2 61.2,48.2 RN9.5
~D4
  Top 0.127: IC3.C9 52.8,47.2 55.08,47.19 60.42,47.19 60.51,47.28 RN9.6
~D5
  Top 0.127: IC3.B8 53.6,48.8 55.28,48.79 62.74,48.79 63.3,49.35 RN4.8
~D6
  Top 0.127: IC3.A7 55.08,49.19 62.42,49.19 63.47,50.24 64.23,50.24 RN4.7
~D7
  Top 0.127: IC3.B5 53.6,51.2 55.28,51.19 58.76,51.19 60.53,52.96 RN3.8
~D8  (via drill 0.2)
  Top 0.127: IC3.D5 52,51.2 v52.8,51.2 | v60.42,53.84 RN3.7
  Bottom 0.127: v52.8,51.2 54.06,51.6 55.7,51.58 57.98,51.59 v60.42,53.84
~D9
  Top 0.127: IC3.A4 55.08,51.59 57.55,51.59 60.58,54.62 61.23,54.62 RN3.6
~D10
  Top 0.127: IC3.B4 53.6,52 55.08,51.99 57.33,51.99 60.85,55.51 RN3.5
~D11
  Top 0.127: IC3.B3 53.6,52.8 55.28,52.79 57.3,52.79 60.81,56.3 RN2.4
~D12
  Top 0.127: IC3.A1 55.28,53.99 57.66,53.98 60.85,57.17 RN2.3
~D13
  Top 0.127: IC3.C11 52.4,44.24 52.87,43.77 RN10.6
~D14
  Top 0.127: IC3.D10 51.2,46.4 51.2,43.37 51.84,42.62 54.51,42.62 55.02,42.11 64.23,42.11 RN10.8
~D15
  Top 0.127: IC3.D11 51.6,44.33 52.94,42.99 64.23,42.99 RN10.7
~SCK
  Top 0.127: IC3.L10 42.31,46.8 39.38,43.87 34.77,43.87 RN11.6
~SI  (via drill 0.2)
  Top 0.127: IC3.J9 v47.2,47.2 | v35.92,44.62 34.78,44.62 RN11.7
  Bottom 0.127: v47.2,47.2 42.12,47.2 39.57,44.65 35.95,44.65 v35.92,44.62
~SO
  Top 0.127: IC3.K9 46.4,47.2 41.09,47.2 39.4,45.51 34.77,45.51 RN11.8

## Text on the board
tPlace: - | + | IceLogic | Copyright Alan Wood 2021 | @folknology www.mystorm.dev
tStop: Thanks to contributors @lawriegriffith, @iposthuman, @tnt | Bus | Tributes to @gatecat, @oe1cxw, @whitequark at @YosysHQ